# Altium schematic sheet GMRpcb.SchDoc
size A4
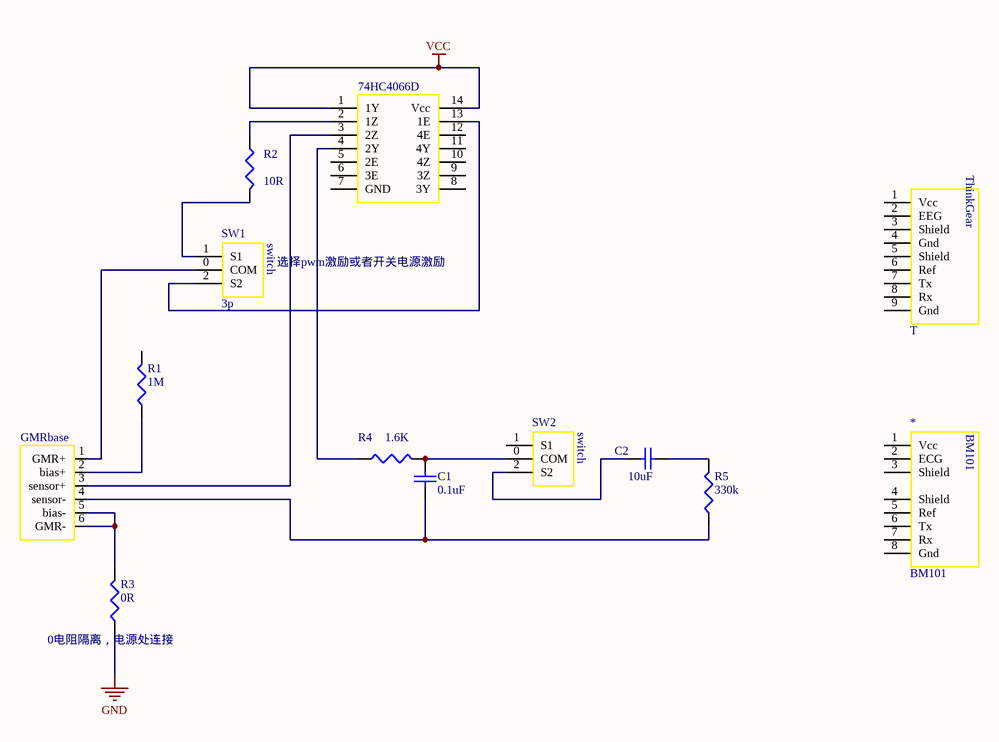
[diagram p0: GMRpcb.SchDoc]

## Parts
74HC4066  74HC4066D  [74HC4066D]  (value not drawn)
*  BM101  [BM101]
C1  cap0402  [cap0402]  (value not drawn)
C2  cap0402  [cap0402]  (value not drawn)
GMRbase  GMRbase  [GMRbase]  (value not drawn)
R1  R  [res0402]  (value not drawn)
R2  R  [res0402]  (value not drawn)
R3  R  [res0402]  (value not drawn)
R4  R  [res0402]  (value not drawn)
R5  R  [res0402]  (value not drawn)
SW1  3p  [3p]
SW2  3p  [3p]  (value not drawn)
T  ThinkGear  [ThinkGear]  (value not drawn)

## Nets
GND: R3.1
VCC: 74HC4066.1(1Y) 74HC4066.14(Vcc)
Net74HC4066_2: 74HC4066.2(1Z) R2.1
Net74HC4066_3: 74HC4066.3(2Z) GMRbase.3(sensor+)
Net74HC4066_4: 74HC4066.4(2Y) R4.1
Net74HC4066_13: 74HC4066.13(1E) SW1.2(S2)
NetC1_1: C1.1 GMRbase.4(sensor-) R5.1
NetC1_2: C1.2 R4.2 SW2.0(COM)
NetC2_1: C2.1 SW2.2(S2)
NetC2_2: C2.2 R5.2
NetGMRbase_1: GMRbase.1(GMR+) SW1.0(COM)
NetGMRbase_2: GMRbase.2(bias+) R1.1
NetGMRbase_5: GMRbase.5(bias-) GMRbase.6(GMR-) R3.2
NetR2_2: R2.2 SW1.1(S1)

Not connected (* = marked no-connect by the designer): 74HC4066 5(2E) 6(3E) 7(GND) 8(3Y) 9(3Z) 10(4Z) 11(4Y) 12(4E); * 1(Vcc) 2(ECG) 3(Shield) 4(Shield) 5(Ref) 6(Tx) 7(Rx) 8(Gnd); R1 2; SW2 1(S1); T 1(Vcc) 2(EEG) 3(Shield) 4(Gnd) 5(Shield) 6(Ref) 7(Tx) 8(Rx) 9(Gnd)

## Notes on the sheet
- 选择pwm激励或者开关电源激励
- (near R3) 0电阻隔离，电源处连接
- (in symbol 3p) switch
- (in symbol cap0402) 0.1uF; 10uF
- (in symbol res0402) 10R; 1M; 0R; 1.6K; 330k

## Library data of the parts
R1-R5 = res0402